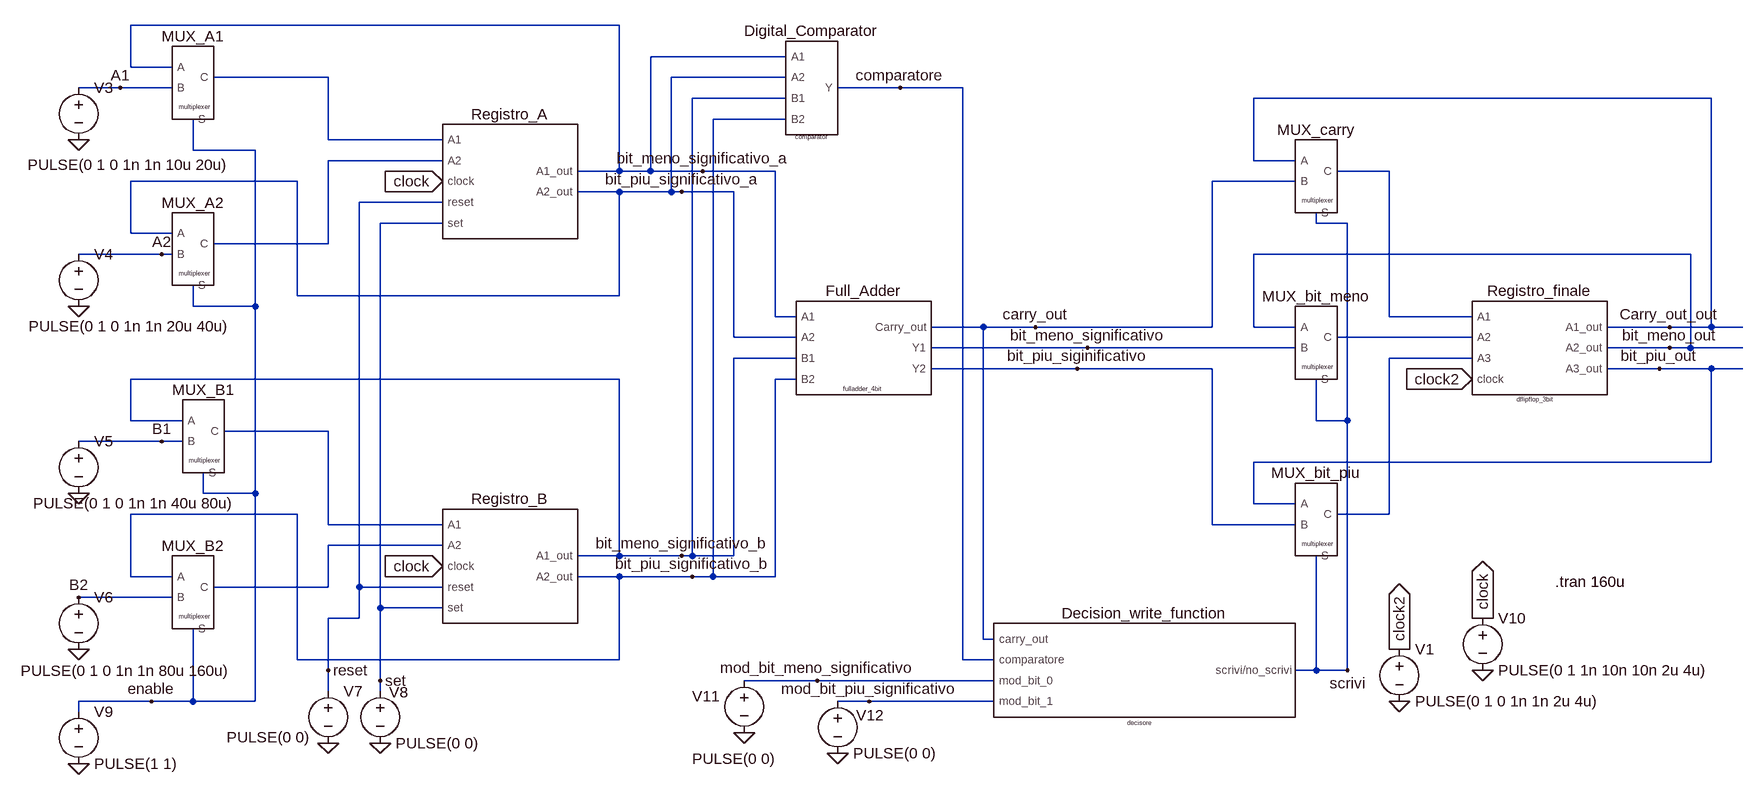
[diagram p0: schematic progetto1.3.asc]
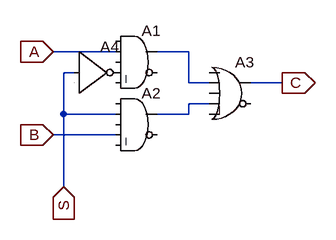
[diagram p1: sub-circuit multiplexer.asc]
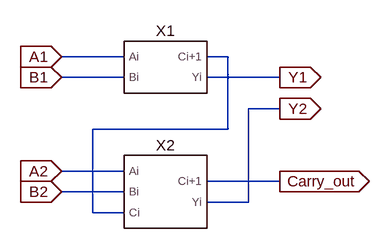
[diagram p2: sub-circuit fulladder_4bit.asc]
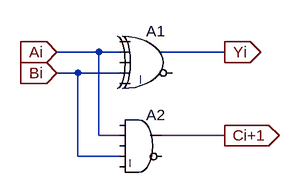
[diagram p3: sub-circuit halfadder.asc]
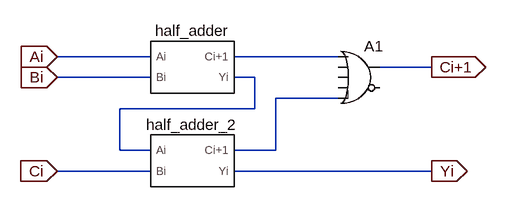
[diagram p4: sub-circuit fulladder.asc]
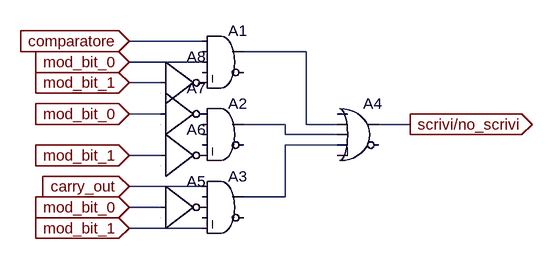
[diagram p5: sub-circuit decisore.asc]
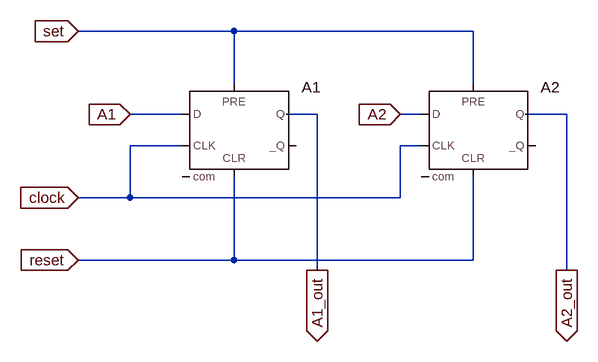
[diagram p6: sub-circuit dflipflop_2bit_con_set_reset.asc]
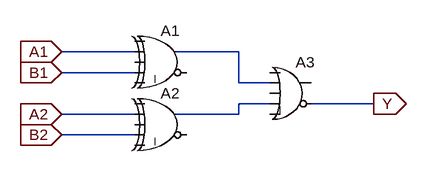
[diagram p7: sub-circuit comparator.asc]
progetto1.3.asc, the LTspice schematic file:
Version 4
SHEET 1 4436 2356
WIRE 1184 96 432 96
WIRE 1440 144 1232 144
WIRE 432 160 432 96
WIRE 496 160 432 160
WIRE 736 176 560 176
WIRE 1440 176 1264 176
WIRE 416 192 352 192
WIRE 496 192 416 192
WIRE 1616 192 1520 192
WIRE 1712 192 1616 192
WIRE 1440 208 1296 208
WIRE 2864 208 2160 208
WIRE 1440 240 1328 240
WIRE 736 272 736 176
WIRE 912 272 736 272
WIRE 528 288 528 240
WIRE 624 288 528 288
WIRE 912 304 736 304
WIRE 2160 304 2160 208
WIRE 2224 304 2160 304
WIRE 1184 320 1184 96
WIRE 1184 320 1120 320
WIRE 1232 320 1232 144
WIRE 1232 320 1184 320
WIRE 1312 320 1232 320
WIRE 1424 320 1312 320
WIRE 2368 320 2288 320
WIRE 688 336 432 336
WIRE 2224 336 2096 336
WIRE 1184 352 1120 352
WIRE 1264 352 1264 176
WIRE 1264 352 1184 352
WIRE 1280 352 1264 352
WIRE 1360 352 1280 352
WIRE 912 368 784 368
WIRE 912 400 816 400
WIRE 2256 400 2256 384
WIRE 2304 400 2256 400
WIRE 432 416 432 336
WIRE 496 416 432 416
WIRE 736 432 736 304
WIRE 736 432 560 432
WIRE 480 448 352 448
WIRE 496 448 480 448
WIRE 2832 448 2160 448
WIRE 688 512 688 336
WIRE 1184 512 1184 352
WIRE 1184 512 688 512
WIRE 528 528 528 496
WIRE 624 528 624 288
WIRE 624 528 528 528
WIRE 1424 544 1424 320
WIRE 1456 544 1424 544
WIRE 2368 544 2368 320
WIRE 2496 544 2368 544
WIRE 1744 560 1664 560
WIRE 1824 560 1744 560
WIRE 2096 560 2096 336
WIRE 2096 560 1824 560
WIRE 2160 560 2160 448
WIRE 2224 560 2160 560
WIRE 2800 560 2704 560
WIRE 2864 560 2864 208
WIRE 2864 560 2800 560
WIRE 2912 560 2864 560
WIRE 1360 576 1360 352
WIRE 1456 576 1360 576
WIRE 2496 576 2288 576
WIRE 1904 592 1664 592
WIRE 2224 592 1904 592
WIRE 2800 592 2704 592
WIRE 2832 592 2832 448
WIRE 2832 592 2800 592
WIRE 2912 592 2832 592
WIRE 1456 608 1360 608
WIRE 2496 608 2368 608
WIRE 1888 624 1664 624
WIRE 2096 624 1888 624
WIRE 2784 624 2704 624
WIRE 2864 624 2784 624
WIRE 2912 624 2864 624
WIRE 1184 640 432 640
WIRE 1456 640 1424 640
WIRE 432 704 432 640
WIRE 512 704 432 704
WIRE 2256 704 2256 640
WIRE 2304 704 2304 400
WIRE 2304 704 2256 704
WIRE 736 720 576 720
WIRE 480 736 352 736
WIRE 512 736 480 736
WIRE 2864 768 2864 624
WIRE 2864 768 2160 768
WIRE 544 816 544 784
WIRE 624 816 624 528
WIRE 624 816 544 816
WIRE 2160 832 2160 768
WIRE 2224 832 2160 832
WIRE 688 848 432 848
WIRE 2368 848 2368 608
WIRE 2368 848 2288 848
WIRE 736 864 736 720
WIRE 912 864 736 864
WIRE 2096 864 2096 624
WIRE 2224 864 2096 864
WIRE 912 896 736 896
WIRE 1184 912 1184 640
WIRE 1184 912 1120 912
WIRE 1280 912 1184 912
WIRE 1296 912 1296 208
WIRE 1296 912 1280 912
WIRE 1360 912 1360 608
WIRE 1360 912 1296 912
WIRE 432 944 432 848
WIRE 496 944 432 944
WIRE 1184 944 1120 944
WIRE 1296 944 1184 944
WIRE 1328 944 1328 240
WIRE 1328 944 1296 944
WIRE 1424 944 1424 640
WIRE 1424 944 1328 944
WIRE 736 960 736 896
WIRE 736 960 560 960
WIRE 784 960 784 368
WIRE 912 960 784 960
WIRE 496 976 352 976
WIRE 816 992 816 400
WIRE 912 992 816 992
WIRE 784 1008 784 960
WIRE 784 1008 736 1008
WIRE 1744 1040 1744 560
WIRE 1760 1040 1744 1040
WIRE 688 1072 688 848
WIRE 1184 1072 1184 944
WIRE 1184 1072 688 1072
WIRE 1712 1072 1712 192
WIRE 1760 1072 1712 1072
WIRE 736 1088 736 1008
WIRE 2256 1088 2256 912
WIRE 2256 1088 2224 1088
WIRE 2304 1088 2304 704
WIRE 2304 1088 2256 1088
WIRE 816 1104 816 992
WIRE 1488 1104 1376 1104
WIRE 1760 1104 1488 1104
WIRE 736 1120 736 1088
WIRE 816 1120 816 1104
WIRE 464 1136 352 1136
WIRE 528 1136 528 1024
WIRE 528 1136 464 1136
WIRE 624 1136 624 816
WIRE 624 1136 528 1136
WIRE 1568 1136 1520 1136
WIRE 1760 1136 1568 1136
WIRE 352 1152 352 1136
FLAG 352 272 0
FLAG 352 528 0
FLAG 352 816 0
FLAG 352 1056 0
FLAG 736 1200 0
FLAG 816 1200 0
FLAG 352 1232 0
FLAG 2512 1088 0
FLAG 2512 1008 clock
IOPIN 2512 1008 Out
FLAG 912 336 clock
IOPIN 912 336 In
FLAG 912 928 clock
IOPIN 912 928 In
FLAG 1376 1184 0
FLAG 1520 1216 0
FLAG 2496 640 clock2
IOPIN 2496 640 In
FLAG 736 1088 reset
FLAG 816 1104 set
FLAG 464 1136 enable
FLAG 416 192 A1
FLAG 480 448 A2
FLAG 480 736 B1
FLAG 352 976 B2
FLAG 1488 1104 mod_bit_meno_significativo
FLAG 1568 1136 mod_bit_piu_significativo
FLAG 2304 1088 scrivi
FLAG 1280 352 bit_piu_significativo_a
FLAG 1312 320 bit_meno_significativo_a
FLAG 1296 944 bit_piu_significativo_b
FLAG 1280 912 bit_meno_significativo_b
FLAG 1616 192 comparatore
FLAG 1824 560 carry_out
FLAG 1904 592 bit_meno_significativo
FLAG 1888 624 bit_piu_siginificativo
FLAG 2384 1136 0
FLAG 2384 1056 clock2
IOPIN 2384 1056 Out
FLAG 2800 560 Carry_out_out
FLAG 2800 592 bit_meno_out
FLAG 2784 624 bit_piu_out
SYMBOL voltage 352 176 R0
WINDOW 123 0 0 Left 0
WINDOW 39 0 0 Left 0
WINDOW 3 -78 134 Left 2
SYMATTR InstName V3
SYMATTR Value PULSE(0 1 0 1n 1n 10u 20u)
SYMBOL voltage 352 432 R0
WINDOW 123 0 0 Left 0
WINDOW 39 0 0 Left 0
WINDOW 3 -77 127 Left 2
SYMATTR InstName V4
SYMATTR Value PULSE(0 1 0 1n 1n 20u 40u)
SYMBOL voltage 352 720 R0
WINDOW 123 0 0 Left 0
WINDOW 39 0 0 Left 0
WINDOW 3 -70 111 Left 2
SYMATTR InstName V5
SYMATTR Value PULSE(0 1 0 1n 1n 40u 80u)
SYMBOL voltage 352 960 R0
WINDOW 123 0 0 Left 0
WINDOW 39 0 0 Left 0
WINDOW 3 -89 129 Left 2
SYMATTR InstName V6
SYMATTR Value PULSE(0 1 0 1n 1n 80u 160u)
SYMBOL multiplexer 528 176 R0
SYMATTR InstName MUX_A1
SYMBOL multiplexer 528 432 R0
SYMATTR InstName MUX_A2
SYMBOL multiplexer 544 720 R0
SYMATTR InstName MUX_B1
SYMBOL multiplexer 528 960 R0
SYMATTR InstName MUX_B2
SYMBOL voltage 736 1104 R0
WINDOW 123 0 0 Left 0
WINDOW 39 0 0 Left 0
WINDOW 3 -156 87 Left 2
SYMATTR Value PULSE(0 0)
SYMATTR InstName V7
SYMBOL voltage 816 1104 R0
WINDOW 123 0 0 Left 0
WINDOW 39 0 0 Left 0
WINDOW 0 14 18 Left 2
SYMATTR InstName V8
SYMATTR Value PULSE(0 0)
SYMBOL voltage 352 1136 R0
WINDOW 123 0 0 Left 0
WINDOW 39 0 0 Left 0
SYMATTR InstName V9
SYMATTR Value PULSE(1 1)
SYMBOL voltage 2512 992 R0
WINDOW 123 0 0 Left 0
WINDOW 39 0 0 Left 0
SYMATTR InstName V10
SYMATTR Value PULSE(0 1 1n 10n 10n 2u 4u)
SYMBOL fulladder_4bit 1552 592 R0
SYMATTR InstName Full_Adder
SYMBOL decisore 1984 1088 R0
SYMATTR InstName Decision_write_function
SYMBOL voltage 1376 1088 R0
WINDOW 123 0 0 Left 0
WINDOW 39 0 0 Left 0
WINDOW 0 -80 40 Left 2
WINDOW 3 -80 136 Left 2
SYMATTR InstName V11
SYMATTR Value PULSE(0 0)
SYMBOL voltage 1520 1120 R0
WINDOW 123 0 0 Left 0
WINDOW 39 0 0 Left 0
WINDOW 0 28 37 Left 2
SYMATTR InstName V12
SYMATTR Value PULSE(0 0)
SYMBOL multiplexer 2256 320 R0
SYMATTR InstName MUX_carry
SYMBOL multiplexer 2256 576 R0
SYMATTR InstName MUX_bit_meno
SYMBOL multiplexer 2256 848 R0
SYMATTR InstName MUX_bit_piu
SYMBOL dflipflop_2bit_con_set_reset 1008 336 R0
SYMATTR InstName Registro_A
SYMBOL dflipflop_2bit_con_set_reset 1008 928 R0
SYMATTR InstName Registro_B
SYMBOL comparator 1472 192 R0
SYMATTR InstName Digital_Comparator
SYMBOL dflipflop_3bit 2592 592 R0
SYMATTR InstName Registro_finale
SYMBOL voltage 2384 1040 R0
WINDOW 123 0 0 Left 0
WINDOW 39 0 0 Left 0
SYMATTR InstName V1
SYMATTR Value PULSE(0 1 0 1n 1n 2u 4u)
TEXT 2624 952 Left 2 !.tran 160u

multiplexer.asc, the sub-circuit schematic file:
Version 4
SHEET 1 880 680
WIRE 48 112 -48 112
WIRE 160 112 112 112
WIRE -16 144 -32 144
WIRE 160 160 160 112
WIRE 192 160 160 160
WIRE 304 160 256 160
WIRE 192 192 160 192
WIRE -32 208 -32 144
WIRE 48 208 -32 208
WIRE 160 208 160 192
WIRE 160 208 112 208
WIRE 48 240 -48 240
WIRE -32 320 -32 208
FLAG -48 112 A
IOPIN -48 112 In
FLAG -48 240 B
IOPIN -48 240 In
FLAG -32 320 S
IOPIN -32 320 In
FLAG 304 160 C
IOPIN 304 160 Out
SYMBOL Digital\\and 80 64 R0
SYMATTR InstName A1
SYMBOL Digital\\and 80 160 R0
SYMATTR InstName A2
SYMBOL Digital\\or 224 112 R0
SYMATTR InstName A3
SYMBOL Digital\\inv -16 80 R0
SYMATTR InstName A4

fulladder_4bit.asc, the sub-circuit schematic file:
Version 4
SHEET 1 880 680
WIRE 32 144 -64 144
WIRE 192 144 160 144
WIRE 32 176 -64 176
WIRE 272 176 160 176
WIRE 272 224 224 224
WIRE 192 256 192 144
WIRE 192 256 -16 256
WIRE 32 320 -64 320
WIRE 272 336 160 336
WIRE 32 352 -64 352
WIRE 224 368 224 224
WIRE 224 368 160 368
WIRE -16 384 -16 256
WIRE 32 384 -16 384
FLAG -64 144 A1
IOPIN -64 144 In
FLAG -64 176 B1
IOPIN -64 176 In
FLAG -64 320 A2
IOPIN -64 320 In
FLAG -64 352 B2
IOPIN -64 352 In
FLAG 272 176 Y1
IOPIN 272 176 Out
FLAG 272 224 Y2
IOPIN 272 224 Out
FLAG 272 336 Carry_out
IOPIN 272 336 Out
SYMBOL halfadder 96 160 R0
SYMATTR InstName X1
SYMBOL fulladder 96 352 R0
SYMATTR InstName X2

halfadder.asc, the sub-circuit schematic file:
Version 4
SHEET 1 880 680
WIRE 112 176 48 176
WIRE 144 176 112 176
WIRE 304 176 208 176
WIRE 80 208 48 208
WIRE 144 208 80 208
WIRE 112 304 112 176
WIRE 144 304 112 304
WIRE 304 304 208 304
WIRE 80 336 80 208
WIRE 144 336 80 336
FLAG 48 176 Ai
IOPIN 48 176 In
FLAG 48 208 Bi
IOPIN 48 208 In
FLAG 304 176 Yi
IOPIN 304 176 Out
FLAG 304 304 Ci+1
IOPIN 304 304 Out
SYMBOL Digital\\xor 192 128 R0
SYMATTR InstName A1
SYMBOL Digital\\and 176 256 R0
SYMATTR InstName A2

fulladder.asc, the sub-circuit schematic file:
Version 4
SHEET 1 880 680
WIRE 144 176 0 176
WIRE 432 176 272 176
WIRE 576 192 496 192
WIRE 144 208 0 208
WIRE 304 208 272 208
WIRE 432 240 336 240
WIRE 304 256 304 208
WIRE 304 256 96 256
WIRE 96 320 96 256
WIRE 144 320 96 320
WIRE 336 320 336 240
WIRE 336 320 272 320
WIRE 144 352 0 352
WIRE 576 352 272 352
FLAG 0 176 Ai
IOPIN 0 176 In
FLAG 0 208 Bi
IOPIN 0 208 In
FLAG 576 192 Ci+1
IOPIN 576 192 Out
FLAG 0 352 Ci
IOPIN 0 352 In
FLAG 576 352 Yi
IOPIN 576 352 Out
SYMBOL halfadder 208 192 R0
SYMATTR InstName half_adder
SYMBOL halfadder 208 336 R0
SYMATTR InstName half_adder_2
SYMBOL Digital\\or 464 144 R0
SYMATTR InstName A1

decisore.asc, the sub-circuit schematic file:
Version 4
SHEET 1 880 680
WIRE 80 96 -32 96
WIRE 240 112 144 112
WIRE 80 128 -32 128
WIRE 16 160 -32 160
WIRE 16 208 -32 208
WIRE 208 224 144 224
WIRE 240 224 240 112
WIRE 288 224 240 224
WIRE 400 224 352 224
WIRE 208 240 208 224
WIRE 288 240 208 240
WIRE 288 256 208 256
WIRE 16 272 -32 272
WIRE 80 320 -32 320
WIRE 208 336 208 256
WIRE 208 336 144 336
WIRE 16 352 -32 352
WIRE 80 384 -32 384
FLAG -32 96 comparatore
IOPIN -32 96 In
FLAG -32 128 mod_bit_0
IOPIN -32 128 In
FLAG -32 160 mod_bit_1
IOPIN -32 160 In
FLAG -32 208 mod_bit_0
IOPIN -32 208 In
FLAG -32 272 mod_bit_1
IOPIN -32 272 In
FLAG -32 320 carry_out
IOPIN -32 320 In
FLAG -32 352 mod_bit_0
IOPIN -32 352 In
FLAG -32 384 mod_bit_1
IOPIN -32 384 In
FLAG 400 224 scrivi/no_scrivi
IOPIN 400 224 Out
SYMBOL Digital\\and 112 64 R0
SYMATTR InstName A1
SYMBOL Digital\\and 112 176 R0
SYMATTR InstName A2
SYMBOL Digital\\and 112 288 R0
SYMATTR InstName A3
SYMBOL Digital\\or 320 176 R0
SYMATTR InstName A4
SYMBOL Digital\\inv 16 208 R0
SYMATTR InstName A6
SYMBOL Digital\\inv 16 144 R0
SYMATTR InstName A7
SYMBOL Digital\\inv 16 288 R0
SYMATTR InstName A5
SYMBOL Digital\\inv 16 96 R0
SYMATTR InstName A8

dflipflop_2bit_con_set_reset.asc, the sub-circuit schematic file:
Version 4
SHEET 1 880 680
WIRE 96 48 -144 48
WIRE 464 48 96 48
WIRE 96 128 96 48
WIRE 464 128 464 48
WIRE 16 176 -64 176
WIRE 224 176 176 176
WIRE 384 176 352 176
WIRE 608 176 544 176
WIRE 16 224 -64 224
WIRE 384 224 352 224
WIRE -64 304 -64 224
WIRE -64 304 -144 304
WIRE 352 304 352 224
WIRE 352 304 -64 304
WIRE 96 400 96 272
WIRE 96 400 -144 400
WIRE 464 400 464 272
WIRE 464 400 96 400
WIRE 224 416 224 176
WIRE 608 416 608 176
FLAG -64 176 A1
IOPIN -64 176 In
FLAG 352 176 A2
IOPIN 352 176 In
FLAG -144 304 clock
IOPIN -144 304 In
FLAG 224 416 A1_out
IOPIN 224 416 Out
FLAG 608 416 A2_out
IOPIN 608 416 Out
FLAG -144 400 reset
IOPIN -144 400 In
FLAG -144 48 set
IOPIN -144 48 In
SYMBOL Digital\\dflop 96 128 R0
SYMATTR InstName A1
SYMBOL Digital\\dflop 464 128 R0
SYMATTR InstName A2

comparator.asc, the sub-circuit schematic file:
Version 4
SHEET 1 880 680
WIRE 112 96 0 96
WIRE 272 96 176 96
WIRE 112 128 0 128
WIRE 272 144 272 96
WIRE 320 144 272 144
WIRE 320 176 272 176
WIRE 480 176 384 176
WIRE 112 192 0 192
WIRE 272 192 272 176
WIRE 272 192 176 192
WIRE 112 224 0 224
FLAG 0 96 A1
IOPIN 0 96 In
FLAG 0 128 B1
IOPIN 0 128 In
FLAG 0 192 A2
IOPIN 0 192 In
FLAG 0 224 B2
IOPIN 0 224 In
FLAG 480 176 Y
IOPIN 480 176 Out
SYMBOL Digital\\xor 160 48 R0
SYMATTR InstName A1
SYMBOL Digital\\xor 160 144 R0
SYMATTR InstName A2
SYMBOL Digital\\or 352 96 R0
SYMATTR InstName A3

dflipflop_3bit.asc, the sub-circuit schematic file:
Version 4
SHEET 1 1060 680
WIRE 16 176 -64 176
WIRE 224 176 176 176
WIRE 384 176 352 176
WIRE 608 176 544 176
WIRE 752 176 704 176
WIRE 960 176 912 176
WIRE 16 224 -64 224
WIRE 384 224 352 224
WIRE 752 224 704 224
WIRE -64 304 -64 224
WIRE -64 304 -128 304
WIRE 352 304 352 224
WIRE 352 304 -64 304
WIRE 704 304 704 224
WIRE 704 304 352 304
WIRE 224 336 224 176
WIRE 608 336 608 176
WIRE 960 336 960 176
FLAG -64 176 A1
IOPIN -64 176 In
FLAG 352 176 A2
IOPIN 352 176 In
FLAG -128 304 clock
IOPIN -128 304 In
FLAG 224 336 A1_out
IOPIN 224 336 Out
FLAG 608 336 A2_out
IOPIN 608 336 Out
FLAG 704 176 A3
IOPIN 704 176 In
FLAG 960 336 A3_out
IOPIN 960 336 Out
SYMBOL Digital\\dflop 96 128 R0
SYMATTR InstName A1
SYMBOL Digital\\dflop 464 128 R0
SYMATTR InstName A2
SYMBOL Digital\\dflop 832 128 R0
SYMATTR InstName A3

The netlist it stands for:
* progetto1.3.asc
V3 A1 0 PULSE(0 1 0 1n 1n 10u 20u)
V4 A2 0 PULSE(0 1 0 1n 1n 20u 40u)
V5 B1 0 PULSE(0 1 0 1n 1n 40u 80u)
V6 B2 0 PULSE(0 1 0 1n 1n 80u 160u)
XMUX_A1 bit_meno_significativo_a A1 enable N001 multiplexer params: multiplexer
XMUX_A2 bit_piu_significativo_a A2 enable N002 multiplexer params: multiplexer
XMUX_B1 bit_meno_significativo_b B1 enable N006 multiplexer params: multiplexer
XMUX_B2 bit_piu_significativo_b B2 enable N007 multiplexer params: multiplexer
V7 reset 0 PULSE(0 0)
V8 set 0 PULSE(0 0)
V9 enable 0 PULSE(1 1)
V10 clock 0 PULSE(0 1 1n 10n 10n 2u 4u)
XFull_Adder bit_meno_significativo_a bit_piu_significativo_a bit_meno_significativo_b bit_piu_significativo_b carry_out bit_meno_significativo bit_piu_siginificativo fulladder_4bit params: fulladder_4bit
XDecision_write_function carry_out comparatore mod_bit_meno_significativo mod_bit_piu_significativo scrivi decisore params: decisore
V11 mod_bit_meno_significativo 0 PULSE(0 0)
V12 mod_bit_piu_significativo 0 PULSE(0 0)
XMUX_carry Carry_out_out carry_out scrivi N003 multiplexer params: multiplexer
XMUX_bit_meno bit_meno_out bit_meno_significativo scrivi N004 multiplexer params: multiplexer
XMUX_bit_piu bit_piu_out bit_piu_siginificativo scrivi N005 multiplexer params: multiplexer
XRegistro_A N001 N002 clock reset set bit_meno_significativo_a bit_piu_significativo_a dflipflop_2bit_con_set_reset params: dflipflop_2bit_con_set_reset
XRegistro_B N006 N007 clock reset set bit_meno_significativo_b bit_piu_significativo_b dflipflop_2bit_con_set_reset params: dflipflop_2bit_con_set_reset
XDigital_Comparator bit_meno_significativo_a bit_piu_significativo_a bit_meno_significativo_b bit_piu_significativo_b comparatore comparator params: comparator
XRegistro_finale N003 N004 N005 clock2 Carry_out_out bit_meno_out bit_piu_out dflipflop_3bit params: dflipflop_3bit
V1 clock2 0 PULSE(0 1 0 1n 1n 2u 4u)

* block symbol definitions
.subckt multiplexer A B S C
A1 0 A 0 P001 0 0 N001 0 AND
A2 0 S 0 B 0 0 N002 0 AND
A3 0 N001 0 N002 0 0 C 0 OR
A4 S 0 0 0 0 P001 0 0 BUF
.ends multiplexer

.subckt fulladder_4bit A1 A2 B1 B2 Carry_out Y1 Y2
XX1 A1 B1 N001 Y1 halfadder params: halfadder
XX2 A2 B2 N001 Carry_out Y2 fulladder params: fulladder
.ends fulladder_4bit

.subckt halfadder Ai Bi Ci+1 Yi
A1 0 Ai 0 Bi 0 0 Yi 0 XOR
A2 0 Ai 0 Bi 0 0 Ci+1 0 AND
.ends halfadder

.subckt fulladder Ai Bi Ci Ci+1 Yi
Xhalf_adder Ai Bi N001 N002 halfadder params: halfadder
Xhalf_adder_2 N002 Ci N003 Yi halfadder params: halfadder
A1 N001 0 0 0 N003 0 Ci+1 0 OR
.ends fulladder

.subckt decisore carry_out comparatore mod_bit_0 mod_bit_1 scrivi/no_scrivi
A1 comparatore 0 mod_bit_0 0 P001 0 N001 0 AND
A2 P002 0 0 0 P003 0 N002 0 AND
A3 carry_out 0 P004 0 mod_bit_1 0 N003 0 AND
A4 0 N001 N002 N003 0 0 scrivi/no_scrivi 0 OR
A6 mod_bit_1 0 0 0 0 P003 0 0 BUF
A7 mod_bit_0 0 0 0 0 P002 0 0 BUF
A5 mod_bit_0 0 0 0 0 P004 0 0 BUF
A8 mod_bit_1 0 0 0 0 P001 0 0 BUF
.ends decisore

.subckt dflipflop_2bit_con_set_reset A1 A2 clock reset set A1_out A2_out
A1 A1 0 clock set reset 0 A1_out 0 DFLOP
A2 A2 0 clock set reset 0 A2_out 0 DFLOP
.ends dflipflop_2bit_con_set_reset

.subckt comparator A1 A2 B1 B2 Y
A1 0 A1 0 B1 0 0 N001 0 XOR
A2 0 A2 0 B2 0 0 N002 0 XOR
A3 0 N001 0 N002 0 Y 0 0 OR
.ends comparator

.subckt dflipflop_3bit A1 A2 A3 clock A1_out A2_out A3_out
A1 A1 0 clock 0 0 0 A1_out 0 DFLOP
A2 A2 0 clock 0 0 0 A2_out 0 DFLOP
A3 A3 0 clock 0 0 0 A3_out 0 DFLOP
.ends dflipflop_3bit

.tran 160u
.backanno
.end